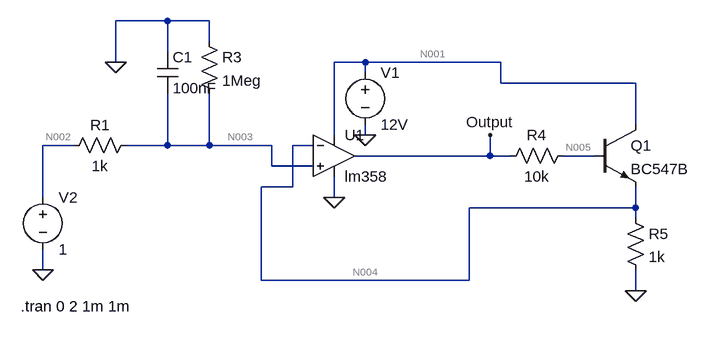
[diagram p0: schematic Cur_Lm_01A.asc]
Cur_Lm_01A.asc, the LTspice schematic file:
Version 4
SHEET 1 880 680
WIRE -80 -64 -160 -64
WIRE -16 -64 -80 -64
WIRE -16 -32 -16 -64
WIRE -80 -16 -80 -64
WIRE -160 0 -160 -64
WIRE 224 0 176 0
WIRE 432 0 224 0
WIRE 224 16 224 0
WIRE 432 32 432 0
WIRE 640 32 432 32
WIRE 640 96 640 32
WIRE 176 112 176 0
WIRE 224 112 224 96
WIRE -224 128 -272 128
WIRE -80 128 -80 48
WIRE -80 128 -144 128
WIRE -16 128 -16 48
WIRE -16 128 -80 128
WIRE 80 128 -16 128
WIRE 144 128 112 128
WIRE 416 144 208 144
WIRE 416 144 416 112
WIRE 448 144 416 144
WIRE 576 144 528 144
WIRE 80 160 80 128
WIRE 144 160 80 160
WIRE 112 192 112 128
WIRE 112 192 64 192
WIRE -272 208 -272 128
WIRE 176 208 176 176
WIRE 640 224 640 192
WIRE 640 224 384 224
WIRE 640 240 640 224
WIRE -272 320 -272 288
WIRE 64 336 64 192
WIRE 384 336 384 224
WIRE 384 336 64 336
WIRE 640 352 640 320
FLAG 224 112 0
FLAG 176 208 0
FLAG -272 320 0
FLAG -160 0 0
FLAG 416 112 Output
FLAG 640 352 0
SYMBOL myLib\\lm358 176 80 R0
SYMATTR InstName U1
SYMBOL res -128 112 R90
WINDOW 0 0 56 VBottom 0
WINDOW 3 32 56 VTop 0
SYMATTR InstName R1
SYMATTR Value 1k
SYMBOL res -32 -48 R0
SYMATTR InstName R3
SYMATTR Value 1Meg
SYMBOL cap -96 -16 R0
SYMATTR InstName C1
SYMATTR Value 100nF
SYMBOL voltage 224 0 R0
WINDOW 123 0 0 Left 0
WINDOW 39 0 0 Left 0
SYMATTR InstName V1
SYMATTR Value 12V
SYMBOL voltage -272 192 R0
WINDOW 123 0 0 Left 0
WINDOW 39 0 0 Left 0
SYMATTR InstName V2
SYMATTR Value 1
SYMBOL npn 576 96 R0
SYMATTR InstName Q1
SYMATTR Value BC547B
SYMBOL res 544 128 R90
WINDOW 0 0 56 VBottom 0
WINDOW 3 32 56 VTop 0
SYMATTR InstName R4
SYMATTR Value 10k
SYMBOL res 624 224 R0
SYMATTR InstName R5
SYMATTR Value 1k
TEXT -306 376 Left 0 !.tran 0 2 1m 1m

The netlist it stands for:
* Cur_Lm_01A.asc
* U1: lm358 (symbol myLib\lm358 not available, pins judged from their places): In+=N003 In-=N004 V+=N001 V-=0 OUT=Output
R1 N003 N002 1k
R3 0 N003 1Meg
C1 0 N003 100nF
V1 N001 0 12V
V2 N002 0 1
Q1 N001 N005 N004 0 BC547B
R4 N005 Output 10k
R5 N004 0 1k
.model NPN NPN
.model PNP PNP
.lib standard.bjt
.tran 0 2 1m 1m
.backanno
.end

* Results of the author's LTspice run, read from the files saved beside the schematic
* Operating Point, zero values left out:
*   V(n004) = 1.001 V
*   V(n003) = 999.1 mV
*   V(n001) = 12 V
*   V(output) = 1.666 V
*   V(n002) = 1 V
*   V(n005) = 1.636 V
*   Ic(Q1) = 997.8 µA
*   Ib(Q1) = 3.023 µA
*   Ie(Q1) = -1.001 mA
*   I(R5) = 1.001 mA
*   I(R4) = -3.023 µA
*   I(R3) = -999.1 nA
*   I(R1) = -947.3 nA
*   I(V2) = -947.3 nA
*   I(V1) = -1.011 mA
*   Ix(u1:1) = -51.76 nA
*   Ix(u1:2) = -38.16 nA
*   Ix(u1:99) = 13.47 µA
*   Ix(u1:50) = -10.36 µA
*   Ix(u1:28) = -3.023 µA